# Altium schematic sheet Master.SchDoc
size A3
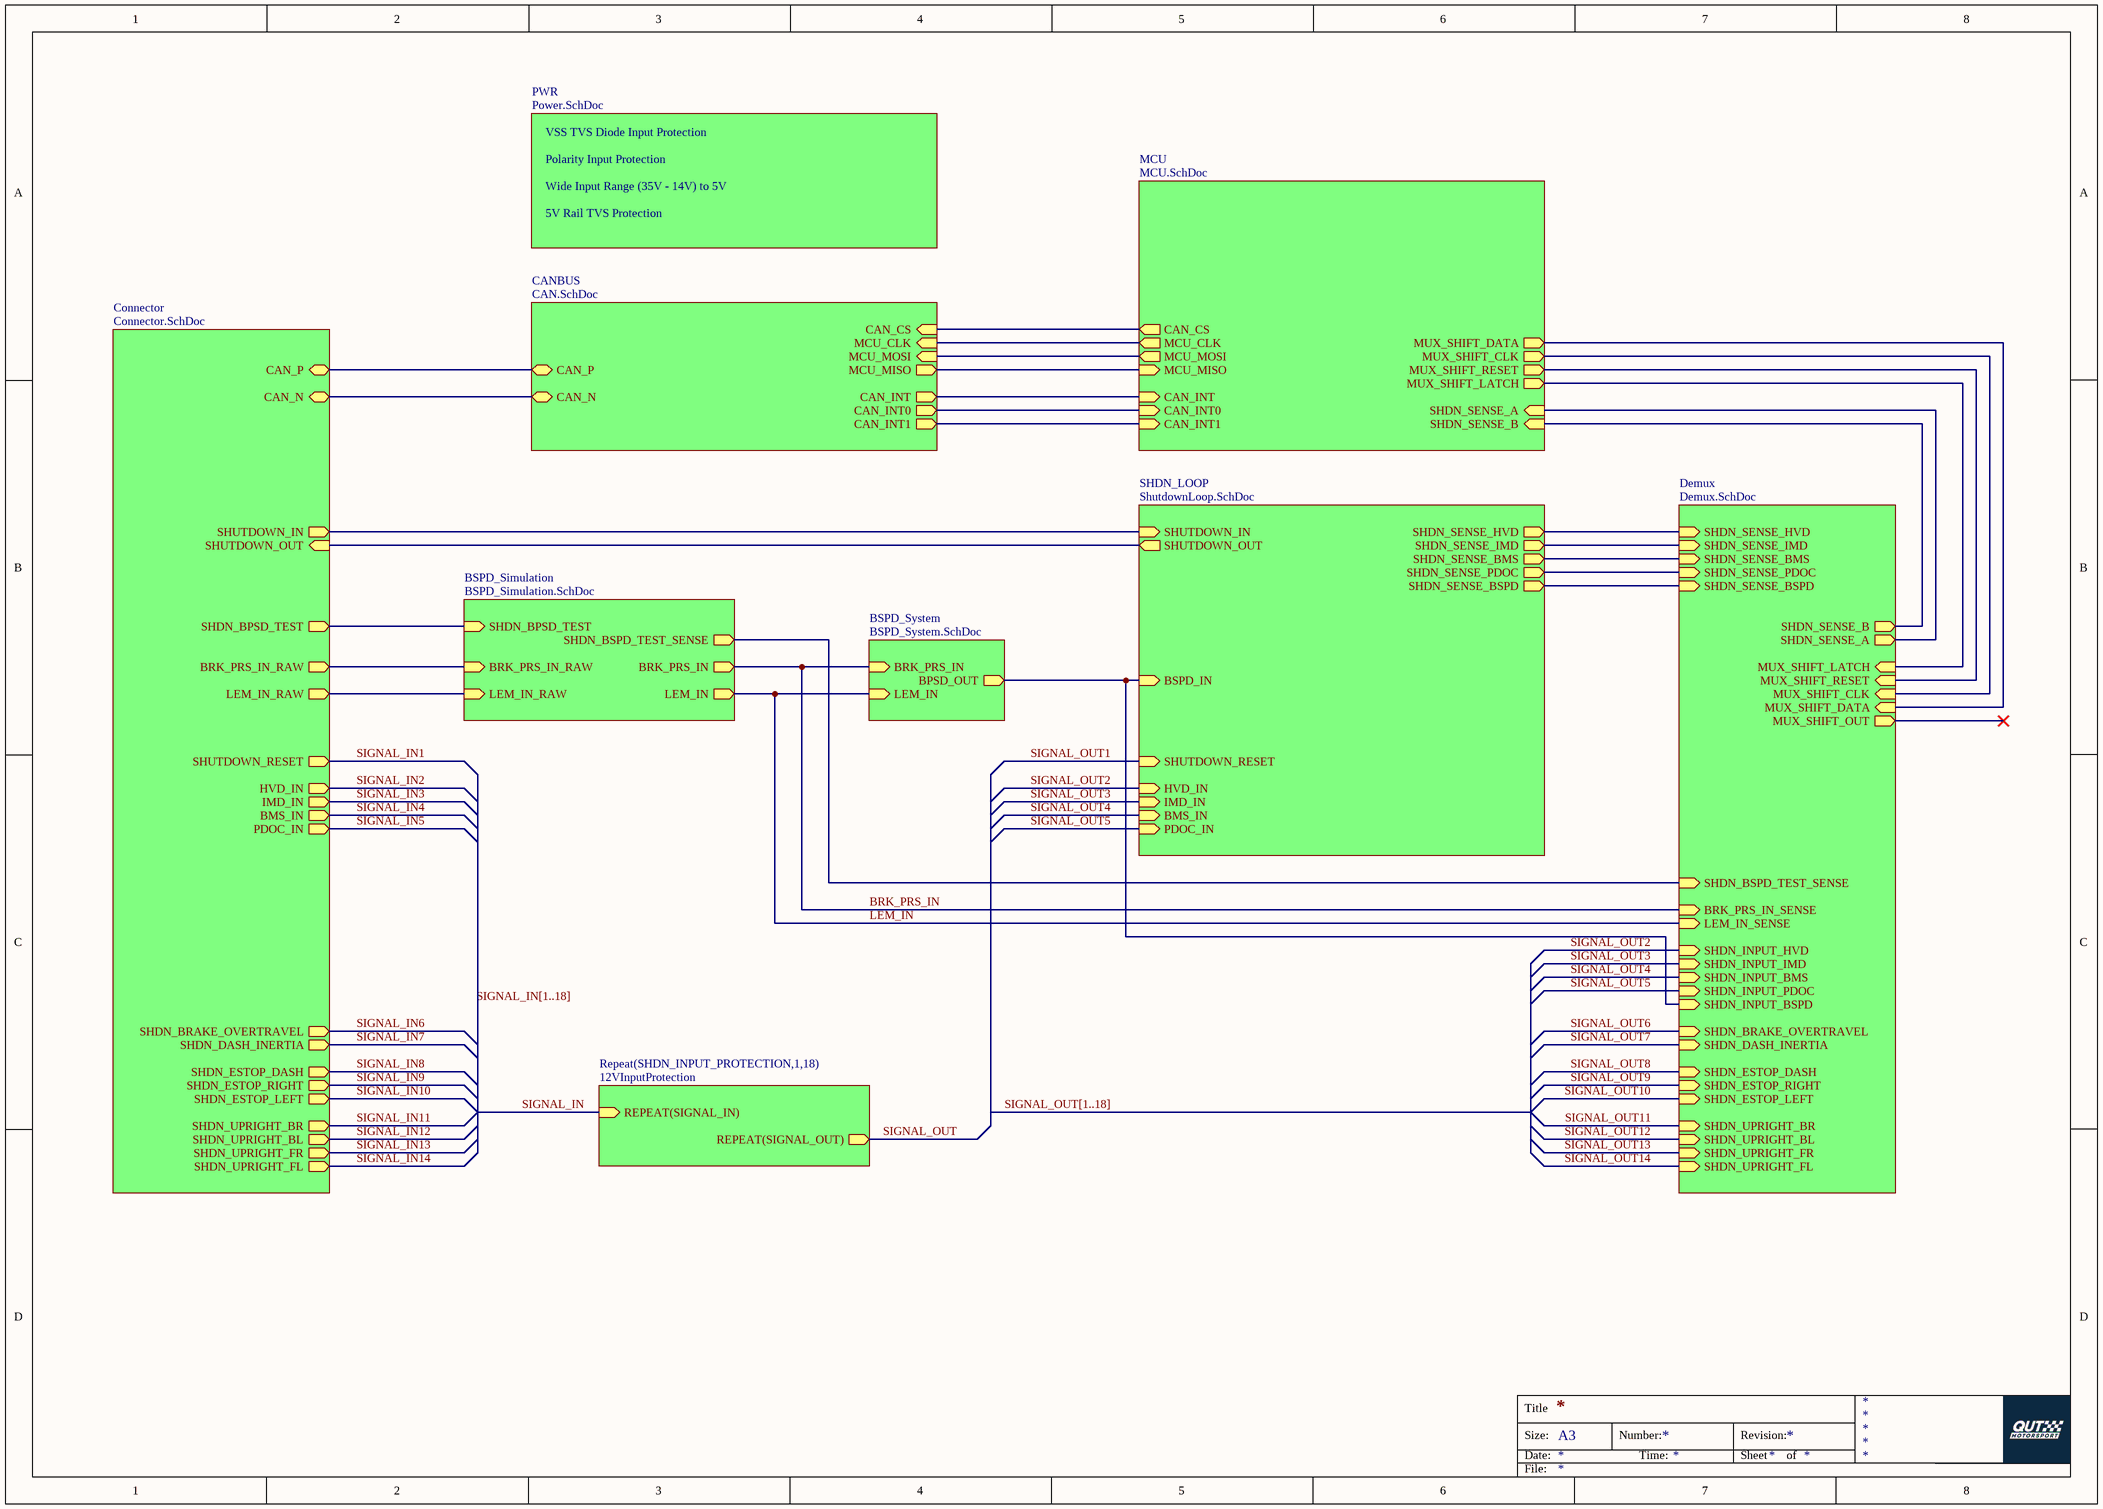
[diagram p0: Master.SchDoc]

## Sub-sheets
BSPD_Simulation = BSPD_Simulation.SchDoc: LEM_IN_RAW (in), SHDN_BSPD_TEST_SENSE (out), BRK_PRS_IN (out), LEM_IN (out), SHDN_BPSD_TEST (in), BRK_PRS_IN_RAW (in)
BSPD_System = BSPD_System.SchDoc: BRK_PRS_IN (in), BPSD_OUT (out), LEM_IN (in)
CANBUS = CAN.SchDoc: MCU_MOSI (in), MCU_CLK (in), CAN_CS (in), MCU_MISO (out), CAN_N (bidir), CAN_P (bidir), CAN_INT1 (out), CAN_INT0 (out), CAN_INT (out)
Connector = Connector.SchDoc: SHDN_BRAKE_OVERTRAVEL (out), SHDN_BPSD_TEST (out), CAN_N (bidir), CAN_P (bidir), SHUTDOWN_IN (out), HVD_IN (out), SHUTDOWN_OUT (in), BRK_PRS_IN_RAW (out), LEM_IN_RAW (out), IMD_IN (out), BMS_IN (out), SHDN_ESTOP_DASH (out), SHDN_DASH_INERTIA (out), PDOC_IN (out), SHUTDOWN_RESET (out), SHDN_ESTOP_RIGHT (out), SHDN_ESTOP_LEFT (out), SHDN_UPRIGHT_BR (out), SHDN_UPRIGHT_BL (out), SHDN_UPRIGHT_FR (out), SHDN_UPRIGHT_FL (out)
Demux = Demux.SchDoc: SHDN_ESTOP_DASH (in), SHDN_UPRIGHT_BL (in), SHDN_UPRIGHT_BR (in), SHDN_ESTOP_LEFT (in), SHDN_ESTOP_RIGHT (in), SHDN_DASH_INERTIA (in), SHDN_UPRIGHT_FR (in), SHDN_UPRIGHT_FL (in), SHDN_BRAKE_OVERTRAVEL (in), SHDN_BSPD_TEST_SENSE (in), BRK_PRS_IN_SENSE (in), LEM_IN_SENSE (in), SHDN_INPUT_HVD (in), SHDN_INPUT_IMD (in), SHDN_INPUT_BMS (in), SHDN_INPUT_PDOC (in), SHDN_INPUT_BSPD (in), SHDN_SENSE_HVD (in), SHDN_SENSE_IMD (in), SHDN_SENSE_BMS (in), SHDN_SENSE_PDOC (in), SHDN_SENSE_BSPD (in), SHDN_SENSE_A (out), MUX_SHIFT_OUT (out), SHDN_SENSE_B (out), MUX_SHIFT_LATCH (in), MUX_SHIFT_RESET (in), MUX_SHIFT_CLK (in), MUX_SHIFT_DATA (in)
MCU = MCU.SchDoc: MCU_MISO (in), MCU_MOSI (out), CAN_CS (out), MCU_CLK (out), CAN_INT (in), CAN_INT0 (in), CAN_INT1 (in), SHDN_SENSE_B (in), SHDN_SENSE_A (in), MUX_SHIFT_LATCH (out), MUX_SHIFT_RESET (out), MUX_SHIFT_CLK (out), MUX_SHIFT_DATA (out)
PWR = Power.SchDoc: no entries
Repeat(SHDN_INPUT_PROTECTION,1,18) = 12VInputProtection: REPEAT(SIGNAL_OUT) (out), REPEAT(SIGNAL_IN) (in)
SHDN_LOOP = ShutdownLoop.SchDoc: SHDN_SENSE_BSPD (out), SHDN_SENSE_PDOC (out), SHDN_SENSE_BMS (out), SHDN_SENSE_IMD (out), HVD_IN (in), SHUTDOWN_RESET (in), IMD_IN (in), BMS_IN (in), PDOC_IN (in), SHUTDOWN_OUT (out), SHUTDOWN_IN (in), BSPD_IN (in), SHDN_SENSE_HVD (out)

## Nets
BRK_PRS_IN: sheet Demux/BRK_PRS_IN_SENSE, sheet BSPD_System/BRK_PRS_IN, sheet BSPD_Simulation/BRK_PRS_IN
LEM_IN: sheet Demux/LEM_IN_SENSE, sheet BSPD_System/LEM_IN, sheet BSPD_Simulation/LEM_IN
SIGNAL_IN: sheet Repeat(SHDN_INPUT_PROTECTION,1,18)/REPEAT(SIGNAL_IN)
SIGNAL_IN1: sheet Connector/SHUTDOWN_RESET
SIGNAL_IN2: sheet Connector/HVD_IN
SIGNAL_IN3: sheet Connector/IMD_IN
SIGNAL_IN4: sheet Connector/BMS_IN
SIGNAL_IN5: sheet Connector/PDOC_IN
SIGNAL_IN6: sheet Connector/SHDN_BRAKE_OVERTRAVEL
SIGNAL_IN7: sheet Connector/SHDN_DASH_INERTIA
SIGNAL_IN8: sheet Connector/SHDN_ESTOP_DASH
SIGNAL_IN9: sheet Connector/SHDN_ESTOP_RIGHT
SIGNAL_IN10: sheet Connector/SHDN_ESTOP_LEFT
SIGNAL_IN11: sheet Connector/SHDN_UPRIGHT_BR
SIGNAL_IN12: sheet Connector/SHDN_UPRIGHT_BL
SIGNAL_IN13: sheet Connector/SHDN_UPRIGHT_FR
SIGNAL_IN14: sheet Connector/SHDN_UPRIGHT_FL
SIGNAL_OUT: sheet Repeat(SHDN_INPUT_PROTECTION,1,18)/REPEAT(SIGNAL_OUT)
SIGNAL_OUT1: sheet SHDN_LOOP/SHUTDOWN_RESET
SIGNAL_OUT2: sheet SHDN_LOOP/HVD_IN, sheet Demux/SHDN_INPUT_HVD
SIGNAL_OUT3: sheet SHDN_LOOP/IMD_IN, sheet Demux/SHDN_INPUT_IMD
SIGNAL_OUT4: sheet SHDN_LOOP/BMS_IN, sheet Demux/SHDN_INPUT_BMS
SIGNAL_OUT5: sheet SHDN_LOOP/PDOC_IN, sheet Demux/SHDN_INPUT_PDOC
SIGNAL_OUT6: sheet Demux/SHDN_BRAKE_OVERTRAVEL
SIGNAL_OUT7: sheet Demux/SHDN_DASH_INERTIA
SIGNAL_OUT8: sheet Demux/SHDN_ESTOP_DASH
SIGNAL_OUT9: sheet Demux/SHDN_ESTOP_RIGHT
SIGNAL_OUT10: sheet Demux/SHDN_ESTOP_LEFT
SIGNAL_OUT11: sheet Demux/SHDN_UPRIGHT_BR
SIGNAL_OUT12: sheet Demux/SHDN_UPRIGHT_BL
SIGNAL_OUT13: sheet Demux/SHDN_UPRIGHT_FR
SIGNAL_OUT14: sheet Demux/SHDN_UPRIGHT_FL
(unnamed): sheet Connector/SHDN_BPSD_TEST, sheet BSPD_Simulation/SHDN_BPSD_TEST
(unnamed): sheet Connector/CAN_N, sheet CANBUS/CAN_N
(unnamed): sheet Connector/CAN_P, sheet CANBUS/CAN_P
(unnamed): sheet Connector/SHUTDOWN_IN, sheet SHDN_LOOP/SHUTDOWN_IN
(unnamed): sheet Connector/SHUTDOWN_OUT, sheet SHDN_LOOP/SHUTDOWN_OUT
(unnamed): sheet Connector/BRK_PRS_IN_RAW, sheet BSPD_Simulation/BRK_PRS_IN_RAW
(unnamed): sheet Connector/LEM_IN_RAW, sheet BSPD_Simulation/LEM_IN_RAW
(unnamed): sheet SHDN_LOOP/SHDN_SENSE_BSPD, sheet Demux/SHDN_SENSE_BSPD
(unnamed): sheet SHDN_LOOP/SHDN_SENSE_PDOC, sheet Demux/SHDN_SENSE_PDOC
(unnamed): sheet SHDN_LOOP/SHDN_SENSE_BMS, sheet Demux/SHDN_SENSE_BMS
(unnamed): sheet SHDN_LOOP/SHDN_SENSE_IMD, sheet Demux/SHDN_SENSE_IMD
(unnamed): sheet SHDN_LOOP/BSPD_IN, sheet Demux/SHDN_INPUT_BSPD, sheet BSPD_System/BPSD_OUT
(unnamed): sheet SHDN_LOOP/SHDN_SENSE_HVD, sheet Demux/SHDN_SENSE_HVD
(unnamed): sheet MCU/MCU_MISO, sheet CANBUS/MCU_MISO
(unnamed): sheet MCU/MCU_MOSI, sheet CANBUS/MCU_MOSI
(unnamed): sheet MCU/CAN_CS, sheet CANBUS/CAN_CS
(unnamed): sheet MCU/MCU_CLK, sheet CANBUS/MCU_CLK
(unnamed): sheet MCU/CAN_INT, sheet CANBUS/CAN_INT
(unnamed): sheet MCU/CAN_INT0, sheet CANBUS/CAN_INT0
(unnamed): sheet MCU/CAN_INT1, sheet CANBUS/CAN_INT1
(unnamed): sheet MCU/SHDN_SENSE_B, sheet Demux/SHDN_SENSE_B
(unnamed): sheet MCU/SHDN_SENSE_A, sheet Demux/SHDN_SENSE_A
(unnamed): sheet MCU/MUX_SHIFT_LATCH, sheet Demux/MUX_SHIFT_LATCH
(unnamed): sheet MCU/MUX_SHIFT_RESET, sheet Demux/MUX_SHIFT_RESET
(unnamed): sheet MCU/MUX_SHIFT_CLK, sheet Demux/MUX_SHIFT_CLK
(unnamed): sheet MCU/MUX_SHIFT_DATA, sheet Demux/MUX_SHIFT_DATA
(unnamed): sheet Demux/SHDN_BSPD_TEST_SENSE, sheet BSPD_Simulation/SHDN_BSPD_TEST_SENSE

## Buses and harness runs
bus SIGNAL_IN[1..18]
bus SIGNAL_OUT[1..18]

## Notes on the sheet
- VSS TVS Diode Input Protection
- Polarity Input Protection
- Wide Input Range (35V - 14V) to 5V
- 5V Rail TVS Protection
- Labels drawn without touching a wire or pin: SIGNAL_IN[1..18]
- Title
- Size:
- Date:
- A3
- Number:
- Time:
- Revision:
- Sheet
- of
- File: